# Altium schematic sheet TPS6513x.SchDoc
size A; SheetNumber: 4; SheetTotal: 4
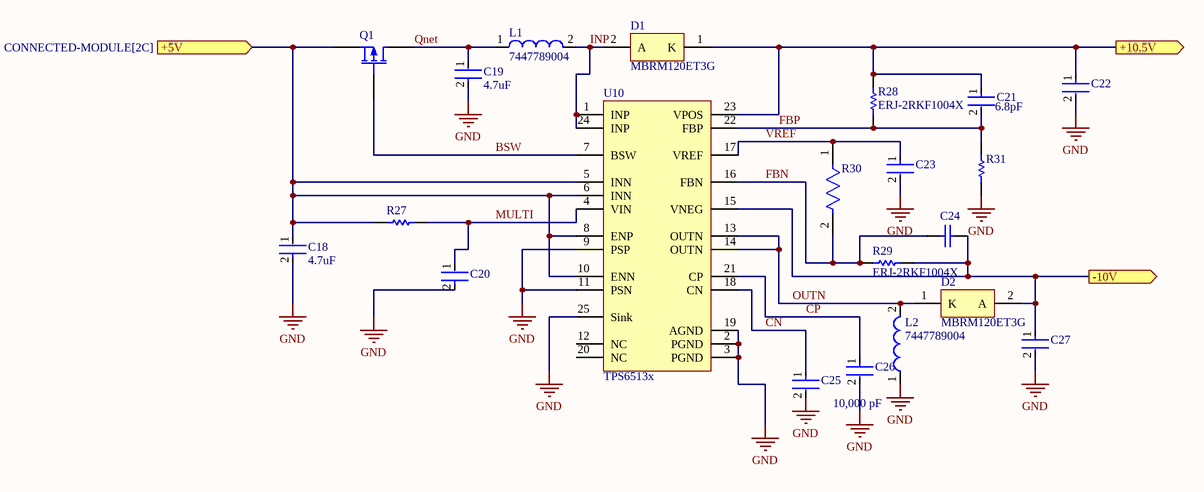
[diagram p0: TPS6513x.SchDoc]

## Parts
C18  4.7uF  [FP-GRM15-MFG]
C19  4.7uF  [FP-GRM15-MFG]
C20  GRM155R71C104KA88D  [FP-GRM15-MFG]  (value not drawn)
C21  Capacitance: 6.8pF  [885012007027]  (hidden comment: CGA1A2C0G1E6R8D030BA)
C22  CL05A226MQ5QUNC  [FP-CL746-IPC_C]  (value not drawn)
C23  GRM155R71C224KA12D  [FP-GRM155-0_05-IPC_C]  (value not drawn)
C24  GRM1555C1H7R5CA01D  [CAPC1005X55X25LL05T10]  (value not drawn)
C25  GRM155R71H472KA01D  [FP-GRM155-0_05-IPC_B]  (value not drawn)
C26  value 10,000 pF  [Yemet_0603]  (hidden comment: C0402C103J4RAC)
C27  CL05A226MQ5QUNC  [FP-CL746-IPC_C]  (value not drawn)
D1  MBRM120ET3G  [ONSC-POWERMITE-2-457-04_D_V]
D2  MBRM120ET3G  [ONSC-POWERMITE-2-457-04_D_V]
L1  7447789004  [WE-PD-S-PB]
L2  7447789004  [WE-PD-S-PB]
Q1  Comment  [PCBComponent_1]  (value not drawn)
R27  ERJ-2RKF1000X  [RESC1005X40X25LL05T05]  (value not drawn)
R28  ERJ-2RKF1004X  [RESC1005X40X25LL05T05]
R29  ERJ-2RKF1004X  [RESC1005X40X25LL05T05]
R30  CRCW0402121KFKED  [FP-CRCW0402-e3-MFG]  (value not drawn)
R31  ERJ-2RKF1303X  [RESC1005X40X25NL05T05]  (value not drawn)
U10  TPS6513x  [TPS6513final]

## Ports
+5V (in, see CONNECTED-MODULE[2C]), +10.5V (out), -10V (out)

## Nets
GND: C18.2 C19.2 C20.2 C22.2 C23.2 C25.2 C26.2 C27.2 L2.1 R31.1 U10.2(PGND) U10.3(PGND) U10.9(PSP) U10.11(PSN) U10.19(AGND) U10.25(Sink)
+5V: C18.1 Q1.3(S) R27.1 U10.5(INN) U10.6(INN) U10.8(ENP) U10.10(ENN) ; port +5V
+10.5V: C21.1 C22.1 D1.1(K) R28.2 U10.23(VPOS) ; port +10.5V
-10V: C24.2 C27.1 D2.2(A) R29.1 U10.15(VNEG) ; port -10V
BSW: Q1.2(G) U10.7(BSW)
CN: C25.1 U10.18(CN)
CP: C26.1 U10.21(CP)
FBN: C24.1 R29.2 R30.2 U10.16(FBN)
FBP: C21.2 R28.1 R31.2 U10.22(FBP)
INP: D1.2(A) L1.2 U10.1(INP) U10.24(INP)
MULTI: C20.1 R27.2 U10.4(VIN)
OUTN: D2.1(K) L2.2 U10.13(OUTN) U10.14(OUTN)
Qnet: C19.1 L1.1 Q1.1(D)
VREF: C23.1 R30.1 U10.17(VREF)

Not connected (* = marked no-connect by the designer): U10 12(NC) 20(NC)

## Library data of the parts
C18 C19 = CMP-2100-03641-2: CAP CER 0.1UF 16V X7R 0402; Manufacturer Part Number: GRM155R71C104KA88D; Manufacturer: Murata; Standoff Height: 0mm; Tolerance: 10%; Description: CAP Ceramic 0.10μF 10% X7R 16Vdc 0402 SMD; Voltage Rating: 16Vdc; Material: Ceramic; Capacitance: 0.10μF; Value: 0.10μF; RoHS: TRUE; Temperature Characteristic: X7R; Octopart: https://octopart.com/grm155r71c104ka88d-murata-196880; Digikey Description: CAP CER 0.1UF 16V X7R 0402; Device Class L3: Ceramic Capacitors; Height: 0.55mm; ComponentLink2Description: Datasheet; Temperature Range Low: -55°C; Ipc Land Pattern Name: CAPC10050X219; ComponentLink2URL: https://search.murata.co.jp/Ceramy/image/img/A01X/G101/ENG/GRM155R71H471KA01-01A.pdf; Device Class L1: Passive Components; Lead Free: yes; Category: Cap; Package: GRM15; Temperature: -55°C to +125°C; Device Class L2: Capacitors; Temperature Range High: +125°C; Mouser Description: 0402 0.1 uF 16V ±10 % Tolerance X7R SMT Multilayer Ceramic Capacitor
C20 = CMP-2100-03641-2: CAP CER 0.1UF 16V X7R 0402; Manufacturer: Murata; Standoff Height: 0mm; Tolerance: 10%; Description: CAP Ceramic 0.10μF 10% X7R 16Vdc 0402 SMD; Voltage Rating: 16Vdc; Material: Ceramic; Capacitance: 0.10μF; Value: 0.10μF; RoHS: TRUE; Manufacturer Part Number: GRM155R71C104KA88D; Temperature Characteristic: X7R; Octopart: https://octopart.com/grm155r71c104ka88d-murata-196880; Digikey Description: CAP CER 0.1UF 16V X7R 0402; Device Class L3: Ceramic Capacitors; Height: 0.55mm; ComponentLink2Description: Datasheet; Temperature Range Low: -55°C; Ipc Land Pattern Name: CAPC10050X219; ComponentLink2URL: https://search.murata.co.jp/Ceramy/image/img/A01X/G101/ENG/GRM155R71H471KA01-01A.pdf; Device Class L1: Passive Components; Lead Free: yes; Category: Cap; Package: GRM15; Temperature: -55°C to +125°C; Device Class L2: Capacitors; Temperature Range High: +125°C; Mouser Description: 0402 0.1 uF 16V ±10 % Tolerance X7R SMT Multilayer Ceramic Capacitor
C21 = b4654b650e69147ec39a6b967a45e02: Cap Ceramic 6.8pF 25V C0G 0.5pF Pad SMD 0201 125°C Automotive T/R; Min Operating Temperature: -55°C; Packaging: Tape and Reel; Mount: Surface Mount; Length: 0.6mm; Dielectric: C0G; Depth: 0.3mm; Ratings: AEC-Q200; Case Code (Metric): 0603; Height: 0.3mm; Weight: 6E-06oz; Case Code (Imperial): 0201; Case/Package: 0201; Thickness: 0.013inch; Voltage Rating: 25V; Package Quantity: 1; Voltage Rating (DC): 25V; Composition: Ceramic; Max Operating Temperature: 125°C; Width: 0.012inch; Termination: SMD/SMT
C22 C27 = CMP-13271-000286-1: Cap Ceramic 22uF 6.3V X5R ±20% SMD 0402 +85°C Paper T/R; Case Code (Imperial): 0402; Tolerance: 20%; Width: 0.02inch; Packaging: Tape and Reel; Case/Package: 0402; Min Operating Temperature: -55°C; Max Operating Temperature: 85°C; Voltage Rating: 6.3V; Capacitance: 22uF; Thickness: 0.022inch; Mount: Surface Mount; Length: 0.039inch; Case Code (Metric): 1005
C23 = CMP-1034-02089-3: Chip Multilayer Ceramic Capacitors for General Purpose, 0402, 0.22uF, X7R, 15%, 10%, 16V; Capacitance: 220nF; Depth: 0.5mm; Dielectric: X7R; Min Operating Temperature: -55°C; Package Quantity: 1; Termination: SMD/SMT; Mount: Surface Mount; Radiation Hardening: No; Height: 0.5mm; Case Code (Metric): 1005; Packaging: Tape and Reel; Material: Ceramic; Voltage: 16V; Voltage Rating (DC): 16V; REACH SVHC: No SVHC; Voltage Rating: 16V; Length: 1mm; Tolerance: 10%; Thickness: 0.022inch; Case Code (Imperial): 0402; Max Operating Temperature: 125°C; Width: 0.02inch; Lead Free: Lead Free; Case/Package: 0402
C24 = CMP-1034-00562-2: Manufacturer: Murata; Part Number: GRM1555C1H7R5CA01D
C25 = CMP-2008-04663-5: Chip Multilayer Ceramic Capacitors for General Purpose, 0402, 4700pF, X7R, 15%, 10%, 50V; Capacitance: 4.7nF; Voltage: 50V; Case/Package: 0402; Termination: SMD/SMT; Case Code (Metric): 1005; Height: 0.5mm; Voltage Rating: 50V; Packaging: Tape and Reel; Width: 0.02inch; Voltage Rating (DC): 50V; Max Operating Temperature: 125°C; Min Operating Temperature: -55°C; Case Code (Imperial): 0402; Material: Ceramic; Lead Free: Lead Free; Length: 1mm; Package Quantity: 1; Thickness: 0.022inch; Dielectric: X7R; Radiation Hardening: No; Depth: 0.5mm; Mount: Surface Mount; Tolerance: 10%; REACH SVHC: No SVHC
C26 = b4654b650e69147ec39a6b967a45e02: C0402 10,000 pF X7R 5.00% 16 V; Manufacturer: Kemet; Tolerance: 0.05; Material: Ceramic; Voltage Rating: 16 V; Temperature Coefficient: 15%; Category: Cap; Manufacturer Part Number: C0402C103J4RAC; ComponentLink2URL: https://content.kemet.com/datasheets/KEM_C1002_X7R_SMD.pdf; Octopart: https://octopart.com/c0402c103j4rac-kemet-8293494; Temperature Range High: +125°C; Temperature: -55°C to +125°C; RoHS: TRUE; Device Class L1: Passive Components; Lead Free: Yes; Temperature Range Low: -55°C; Ipc Land Pattern Name: CAPC10050X50; Package: C0402-BB; Mouser Description: Multilayer Ceramic Capacitors MLCC - SMD/SMT 16volts 0.01uF 5% X7R; Temperature Characteristic: X7R; Device Class L3: Ceramic Capacitors; Height: 0.55mm; Device Class L2: Capacitors; ComponentLink2Description: Datasheet; Capacitance: 10,000 pF; Automotive: No
D1 D2 = CMP-1055-00280-1: Schottky Power Rectifier, 2-Pin Powermite, Pb-Free, Tape and Reel; Manufacturer: On Semiconductor; Configuration: Single; IFSM Max (A): 50; Packing: Tape and Reel; ComponentLink1URL: http://www.onsemi.com/; PartNumber: MBRM120ET3G; Mounting Technology: Surface Mount; PackageReference: POWERMITE-2-457-04; DatasheetVersion: Rev. 3; ComponentLink2URL: http://www.onsemi.cn/pub_link/Collateral/MBRM120E-D.PDF; ComponentLink2Description: Datasheet; PackageVersion: Rev. F, 05/2013; ComponentLink3URL: http://www.onsemi.com/pub_link/Collateral/457-04.PDF; RoHS: TRUE; PackageDescription: 2-Pin POWERMITE, Body 1.965 x 1.9 mm; ComponentLink3Description: Package Specification; ComponentLink1Description: Manufacturer URL
L1 L2 = CMP-1396-00050-1: SMD-Shielded Power Inductor WE-PD, L=4.70 µH; Manufacturer: Wuerth Elektronik; Inductance: 4.70 ÂµH; ComponentLink2URL: http://www.we-online.de/katalog/media/pdf/7447789004.pdf; ComponentLink2Description: Datasheet; PackageDescription: SMD Inductor, 2-Leads, Body 7.3 x 7.3 mm; ComponentLink1Description: Manufacturer URL; PackageReference: WE-PD-S-PB; ComponentLink1URL: http://www.we-online.com; PartNumber: 7447789004
Q1 = MOSFET-P: P-Channel MOSFET; Published: 8-Jun-2000; LatestRevisionDate: 17-Jul-2002; LatestRevisionNote: Re-released for DXP Platform.; PackageVersion: 1995/1996; PackageReference: E3; Publisher: Altium Limited; PackageDescription: TO, Flat Index; 3 In-Line, Axial Leads; Body Dia. 4.6mm; Lead Dia. 0.5 mm (max)
R27 = CMP-2002-00605-3: Chip Resistor, 100 Ohm, +/- 1%, 100 mW, -55 to 155 degC, 0402 (1005 Metric), RoHS, Tape and Reel; Manufacturer: Basic Passives; Power Rating: 100 mW; Resistance: 100 Ohm; Voltage Rating: 50 V; Case\/Package: 0402; Width: 0.5 mm; Pins: 2; ComponentLink2Description: Datasheet; PackageReference: 0402; Height: 0.35 mm; Tolerance: 1%; DatasheetVersion: 04/2015; Case Code (Imperial): 0402; Min Operating Temperature: -55 degC; Radiation Hardening: No; Length: 1 mm; Package Quantity: 10000; PackageDescription: 2-Pin Surface Mount Device, Body 1 x 0.5 mm; Mounting Technology: Surface Mount; Case Code (Metric): 1005; Packaging: Tape and Reel; ComponentLink1URL: http://www.panasonic.com/; RoHSCompliant: true; Max Operating Temperature: 155 degC; REACH SVHC: Yes; PartNumber: ERJ-2RKF1000X; ComponentLink1Description: Manufacturer URL; ComponentLink2URL: http://industrial.panasonic.com/cdbs/www-data/pdf/RDA0000/AOA0000C86.pdf; Mount: Surface Mount
R28 R29 = CMP-2002-00609-3: Chip Resistor, 1 MOhm, +/- 1%, 100 mW, -55 to 155 degC, 0402 (1005 Metric), RoHS, Tape and Reel; Manufacturer: Basic Passives; Voltage Rating: 50 V; Case\/Package: 0402; Resistance: 1 MOhm; Power Rating: 100 mW; Pins: 2; Max Operating Temperature: 155 degC; ComponentLink2URL: http://industrial.panasonic.com/cdbs/www-data/pdf/RDA0000/AOA0000C86.pdf; Weight: 2.8E-05oz; ComponentLink1URL: http://www.panasonic.com/; Radiation Hardening: No; Height: 0.35 mm; Case Code (Imperial): 0402; ComponentLink2Description: Datasheet; Mount: Surface Mount; ComponentLink1Description: Manufacturer URL; REACH SVHC: Yes; PartNumber: ERJ-2RKF1004X; Length: 1 mm; Min Operating Temperature: -55 degC; Width: 0.5 mm; Package Quantity: 10000; Tolerance: 1%; PackageDescription: 2-Pin Surface Mount Device, Body 1 x 0.5 mm; RoHSCompliant: true; DatasheetVersion: 04/2015; PackageReference: 0402; Mounting Technology: Surface Mount; Case Code (Metric): 1005; Packaging: Tape and Reel
R30 = CMP-2002-08171-2: RES Thick Film, 121kΩ, 1%, 0.063W, 100ppm/°C, 0402; Voltage Rating (DC): 50V; Max Power Dissipation: 63mW; Resistance: 121kR; Military Standard: Not; Weight: 2.3E-05oz; Termination: SMD/SMT; Case Code (Metric): 1005; Width: 0.5mm; Tolerance: 1%; Contact Plating: Tin; Temperature Coefficient: 100ppm/°C; Depth: 0.5mm; Length: 1mm; Package Quantity: 10; Radiation Hardening: No; Packaging: Tape and Reel; Power Rating: 63mW; Features: Automotive AEC-Q200; Lead Free: Lead Free; Composition: Thick Film; Min Operating Temperature: -55°C; Height: 0.35mm; Voltage Rating: 50V; Case/Package: 0402; Number of Terminations: 2; Max Operating Temperature: 155°C; Case Code (Imperial): 0402
R31 = CMP-1011-00748-2: Manufacturer: Panasonic; Part Number: ERJ-2RKF1303X
U10 = TI-TPS65130RGE24-2450X2450TP: Boost Inverting Buck-Boost Voltage Converter with 2.7 to 5.5 V Input and -15 to 15 V Output, -40 to 85 degC, 24-Pin VQFN (RGE), Green (RoHS & no Sb/Br); PartNumber: TPS65130RGER; Manufacturer: Texas Instruments; Vout2(V): -15 to -2; Regulated Outputs(#): 2; Switching Frequency(Typ)(kHz): 1400; Vout(Max)(V): 15; Vin(Min)(V): 2.7; SubFamily: Step-Up Regulator; Vin(Max)(V): 5.5; Topology: Boost, Inverting Buck-Boost; ComponentLink2URL: http://www.ti.com/litv/pdf/mpqf124f; ComponentLink2Description: Package Specification; DatasheetVersion: SLVS493B; ComponentLink1Description: Datasheet; Code_JEDEC: MO-220; PackageVersion: revG, Jul-2011; ComponentLink1URL: http://www.ti.com/general/docs/lit/getliterature.tsp?genericPartNumber=TPS65130&fileType=pdf; Eco-Plan: Green (RoHS & no Sb/Br); PackageDescription: 24-Pin Plastic Quad Flatpack No-Lead, 4 x 4 mm Body, 0.5 mm Pitch; PackageReference: RGE0024B; Vout(Min)(V): -15; Mounting Technology: Surface Mount